# Altium project MB1167.PrjPCB (part 2 of 3)

## Sheet MotorControl.SchDoc: Motor Control
size A4; DocumentNumber: MB1167; Revision: B.1; SheetNumber: 13; SheetTotal: 17; Project: STM327x6G-EVAL
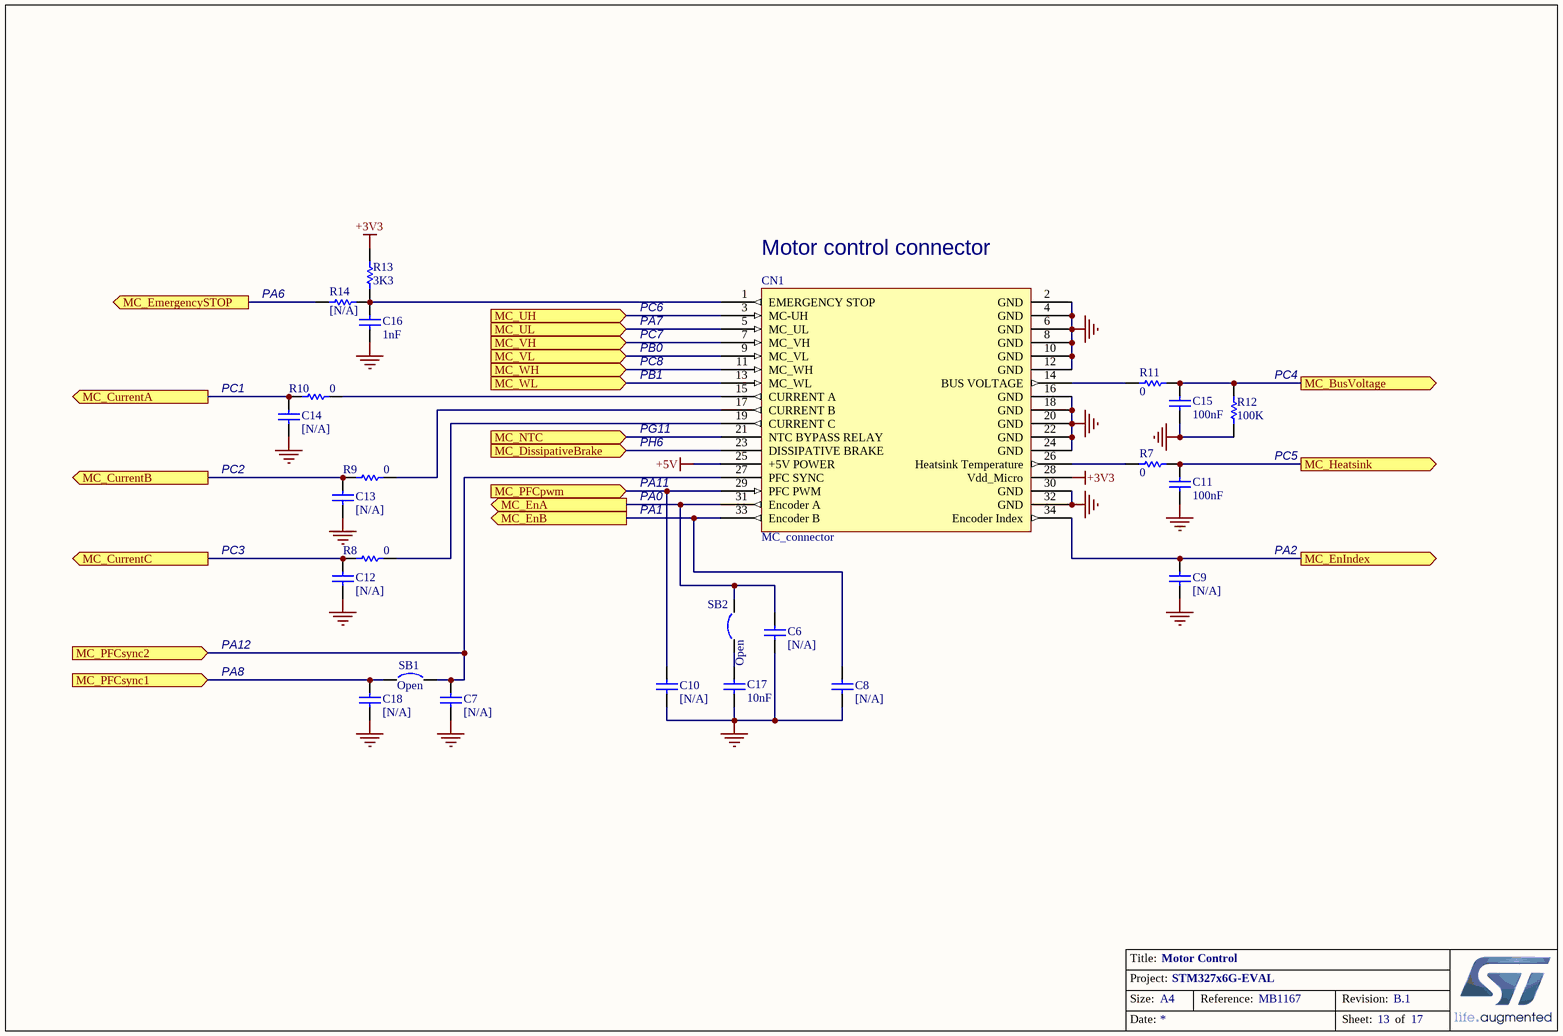
[diagram p7: MotorControl.SchDoc]

### Parts
C6  [N/A]  [0603C]
C7  [N/A]  [0603C]
C8  [N/A]  [0603C]
C9  [N/A]  [0603C]
C10  [N/A]  [0603C]
C11  100nF  [0603C]
C12  [N/A]  [0603C]
C13  [N/A]  [0603C]
C14  [N/A]  [0603C]
C15  100nF  [0603C]
C16  1nF  [0603C]
C17  10nF  [0603C]
C18  [N/A]  [0603C]
CN1  MC_connector  [IDC34S]
R7  0  [0603R]
R8  0  [0603R]
R9  0  [0603R]
R10  0  [0603R]
R11  0  [0603R]
R12  100K  [0603R]
R13  3K3  [0603R]
R14  [N/A]  [0603R]
SB1  Open  [SB_0603]
SB2  Open  [SB_0603]

### Ports
MC_BusVoltage (out), MC_CurrentA (out), MC_CurrentB (out), MC_CurrentC (out), MC_DissipativeBrake (in), MC_EmergencySTOP (out), MC_EnA (out), MC_EnB (out), MC_EnIndex (out), MC_Heatsink (out), MC_NTC (in), MC_PFCpwm (in), MC_PFCsync1 (in), MC_PFCsync2 (in), MC_UH (in), MC_UL (in), MC_VH (in), MC_VL (in), MC_WH (in), MC_WL (in)

### Nets
+3V3: CN1.28(Vdd_Micro) R13.2
+5V: CN1.25(+5V_POWER)
GND: C6.1 C7.1 C8.1 C9.1 C10.1 C11.2 C12.1 C13.1 C14.1 C15.2 C16.1 C17.2 C18.1 CN1.2(GND) CN1.4(GND) CN1.6(GND) CN1.8(GND) CN1.10(GND) CN1.12(GND) CN1.16(GND) CN1.18(GND) CN1.20(GND) CN1.22(GND) CN1.24(GND) CN1.30(GND) CN1.32(GND) R12.2
PA6: R14.2 ; port MC_EmergencySTOP
PAR_D1: CN1.7(MC_VH) ; port MC_VH
NetC6_2: C6.2 CN1.31(Encoder_A) SB2.2 ; port MC_EnA
NetC7_2: C7.2 CN1.27(PFC_SYNC) SB1.2 ; port MC_PFCsync2
NetC8_2: C8.2 CN1.33(Encoder_B) ; port MC_EnB
NetC9_2: C9.2 CN1.34(Encoder_Index) ; port MC_EnIndex
NetC10_2: C10.2 CN1.29(PFC_PWM) ; port MC_PFCpwm
NetC11_1: C11.1 R7.2 ; port MC_Heatsink
NetC12_2: C12.2 R8.1 ; port MC_CurrentC
NetC13_2: C13.2 R9.1 ; port MC_CurrentB
NetC14_2: C14.2 R10.1 ; port MC_CurrentA
NetC15_1: C15.1 R11.2 R12.1 ; port MC_BusVoltage
NetC16_2: C16.2 CN1.1(EMERGENCY_STOP) R13.1 R14.1
NetC17_1: C17.1 SB2.1
NetC18_2: C18.2 SB1.1 ; port MC_PFCsync1
NetCN1_3: CN1.3(MC-UH) ; port MC_UH
NetCN1_5: CN1.5(MC_UL) ; port MC_UL
NetCN1_9: CN1.9(MC_VL) ; port MC_VL
NetCN1_11: CN1.11(MC_WH) ; port MC_WH
NetCN1_13: CN1.13(MC_WL) ; port MC_WL
NetCN1_14: CN1.14(BUS_VOLTAGE) R11.1
NetCN1_15: CN1.15(CURRENT_A) R10.2
NetCN1_17: CN1.17(CURRENT_B) R9.2
NetCN1_19: CN1.19(CURRENT_C) R8.2
NetCN1_21: CN1.21(NTC_BYPASS_RELAY) ; port MC_NTC
NetCN1_23: CN1.23(DISSIPATIVE_BRAKE) ; port MC_DissipativeBrake
NetCN1_26: CN1.26(Heatsink_Temperature) R7.1

### Notes on the sheet
- (near R14) PA6
- PC6
- (near CN1) Motor control connector
- PA7
- PB0
- PB1
- PC7
- PC8
- (near R12) PC4
- PC1
- PG11
- PH6
- PC2
- PA1
- PA0
- PA11
- (near R12) PC5
- PC3
- PA2
- PA12
- PA8
- Title:
- Project:
- Size:
- Date:
- A4
- Reference:
- Sheet:
- Revision:
- of

### Library data of the parts
C6-C10 C12-C14 C18 = cap: Capacitor; Value: 100pF; Published: 8-Jun-2000; Revision: July-2002: Re-released for DXP Platform.; Publisher: Altium Limited
C11 C15 = Cap: Capacitor; Value: 10nF; Published: 8-Jun-2000; Revision: July-2002: Re-released for DXP Platform.; Publisher: Altium Limited
C16 C17 = CAP: Capacitor; Value: 100pF; Published: 8-Jun-2000; Revision: July-2002: Re-released for DXP Platform.; Publisher: Altium Limited
R7-R11 R13 R14 = Res1: Resistor; Value: 1K; Published: 8-Jun-2000; Revision: July-2002: Re-released for DXP Platform.; Publisher: Altium Limited
R12 = res1: Resistor; Value: 1K; Published: 8-Jun-2000; Revision: July-2002: Re-released for DXP Platform.; Publisher: Altium Limited
SB1 SB2 = Circuit Breaker: Published: 24-Mar-1999; Revision: July-2002: Re-released for DXP Platform.; Publisher: Altium Limited

## Sheet Peripherals.SchDoc: Peripherals
size A4; DocumentNumber: MB1167; Revision: B.1; SheetNumber: 12; SheetTotal: 17; Project: STM327x6G-EVAL
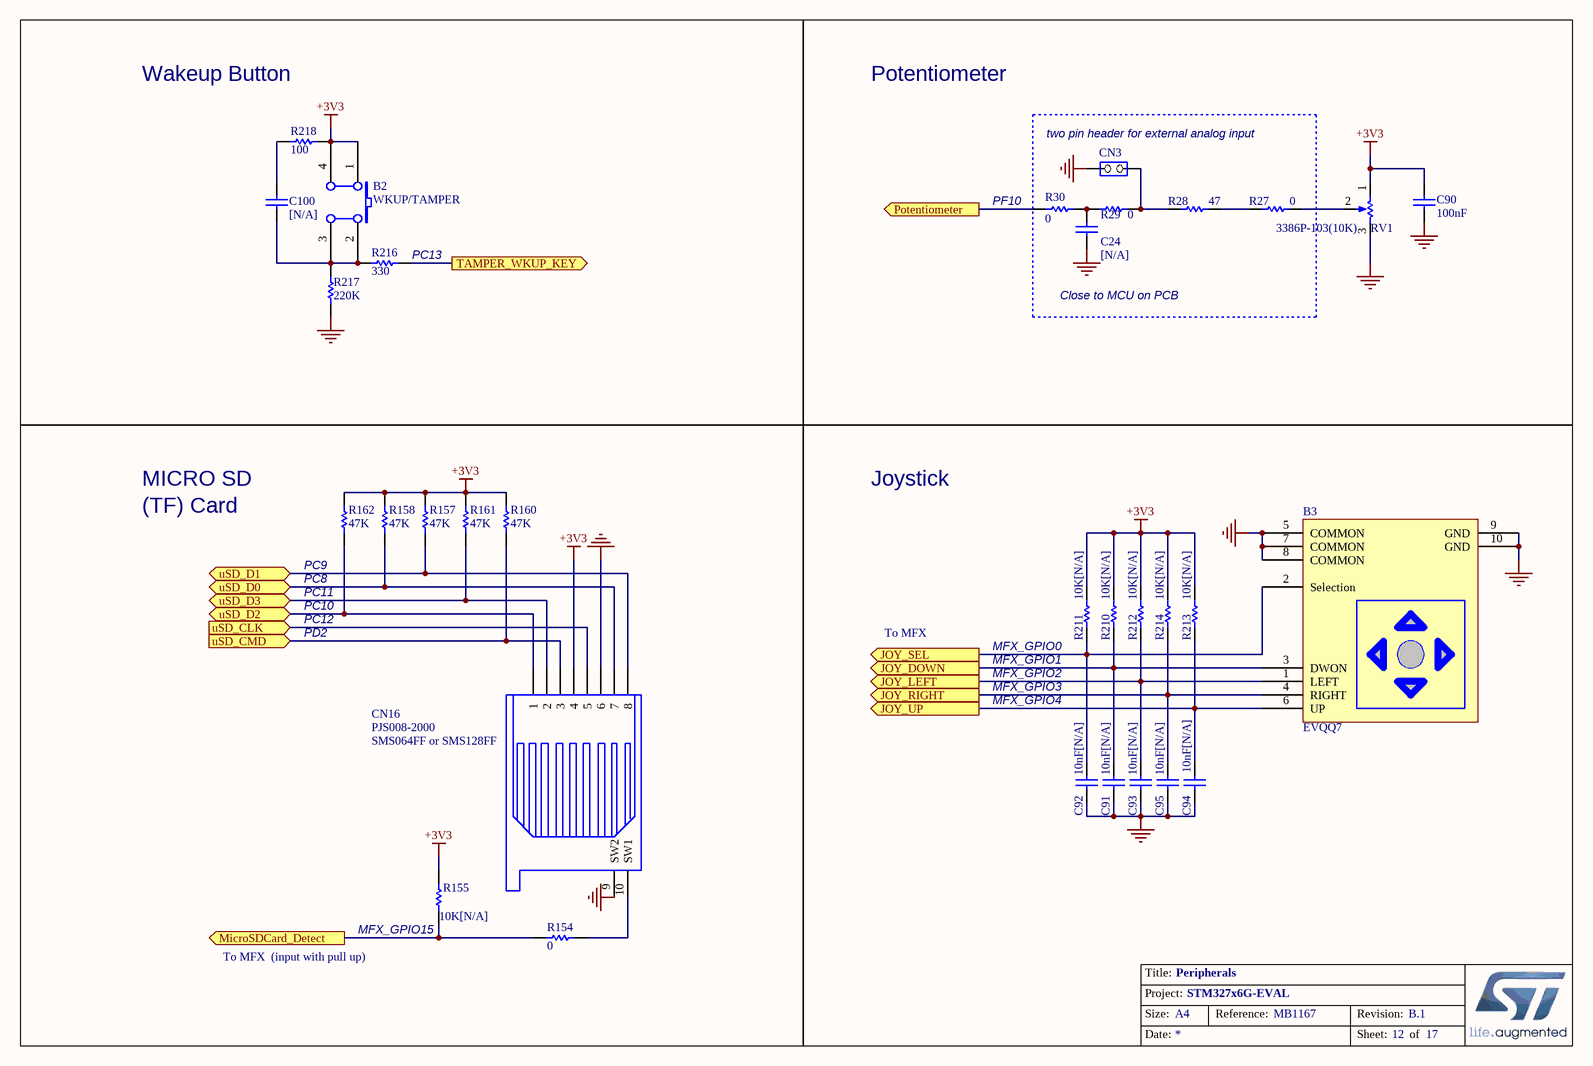
[diagram p8: Peripherals.SchDoc]

### Parts
B2  WKUP/TAMPER  [PB10]
B3  EVQQ7  [SW-JOY]
C24  [N/A]  [0603C]
C90  100nF  [0603C]
C91  10nF[N/A]  [0603C]
C92  10nF[N/A]  [0603C]
C93  10nF[N/A]  [0603C]
C94  10nF[N/A]  [0603C]
C95  10nF[N/A]  [0603C]
C100  [N/A]  [0603C]
CN3  (no value)  [SIP2]
CN16  PJS008-2000  [MSD_PJS008_]
R27  0  [0603R]
R28  47  [0603R]
R29  0  [0603R]
R30  0  [0603R]
R154  0  [0603R]
R155  10K[N/A]  [0603R]
R157  47K  [0603R]
R158  47K  [0603R]
R160  47K  [0603R]
R161  47K  [0603R]
R162  47K  [0603R]
R210  10K[N/A]  [0603R]
R211  10K[N/A]  [0603R]
R212  10K[N/A]  [0603R]
R213  10K[N/A]  [0603R]
R214  10K[N/A]  [0603R]
R216  330  [0603R]
R217  220K  [0603R]
R218  100  [0603R]
RV1  3386P-103(10K)  [3386P]

### Ports
JOY_DOWN (out), JOY_LEFT (out), JOY_RIGHT (out), JOY_SEL (out), JOY_UP (out), MicroSDCard_Detect (out), Potentiometer (out), TAMPER_WKUP_KEY (out), uSD_CLK (in), uSD_CMD (in), uSD_D0 (bidir), uSD_D1 (bidir), uSD_D2 (bidir), uSD_D3 (bidir)

### Nets
+3V3: B2.1(A0) B2.4(A1) C90.1 CN16.4 R155.2 R157.1 R158.1 R160.1 R161.1 R162.1 R210.1 R211.1 R212.1 R213.1 R214.1 R218.1 RV1.1(BOT)
GND: B3.5(COMMON) B3.7(COMMON) B3.8(COMMON) B3.9(GND) B3.10(GND) C24.1 C90.2 C91.1 C92.1 C93.1 C94.1 C95.1 CN3.2(NO) CN16.6 CN16.9(SW2) R217.2 RV1.3(TOP)
PAR_D9: CN16.5 ; port uSD_CLK
PC13: R216.2 ; port TAMPER_WKUP_KEY
NetB2_2: B2.2(B0) B2.3(B1) C100.2 R216.1 R217.1
NetB3_1: B3.1(LEFT) C93.2 R212.2 ; port JOY_LEFT
NetB3_2: B3.2(Selection) C92.2 R211.2 ; port JOY_SEL
NetB3_3: B3.3(DWON) C91.2 R210.2 ; port JOY_DOWN
NetB3_4: B3.4(RIGHT) C95.2 R214.2 ; port JOY_RIGHT
NetB3_6: B3.6(UP) C94.2 R213.2 ; port JOY_UP
NetC24_2: C24.2 R29.1 R30.1
NetC100_1: C100.1 R218.2
NetCN3_1: CN3.1(COMMON) R28.1 R29.2
NetCN16_1: CN16.1 R162.2 ; port uSD_D2
NetCN16_2: CN16.2 R161.2 ; port uSD_D3
NetCN16_3: CN16.3 R160.2 ; port uSD_CMD
NetCN16_7: CN16.7 R158.2 ; port uSD_D0
NetCN16_8: CN16.8 R157.2 ; port uSD_D1
NetCN16_10: CN16.10(SW1) R154.2
NetJP24_1: R30.2 ; port Potentiometer
NetR27_1: R27.1 R28.2
NetR27_2: R27.2 RV1.2(TAP)
NetR154_1: R154.1 R155.1 ; port MicroSDCard_Detect

### Notes on the sheet
- Wakeup Button
- Potentiometer
- (near CN3) two pin header for external analog input
- (near R216) PC13
- (near R30) PF10
- Close to MCU on PCB
- MICRO SD
- (TF) Card
- Joystick
- (near R162) PC8
- (near R162) PC9
- PC11
- PC10
- PC12
- PD2
- To MFX
- (near R211) MFX_GPIO0
- MFX_GPIO1
- MFX_GPIO2
- MFX_GPIO3
- MFX_GPIO4
- (near CN16) SMS064FF or SMS128FF
- (near R155) MFX_GPIO15
- To MFX  (input with pull up)
- Title:
- Project:
- Size:
- Date:
- A4
- Reference:
- Sheet:
- Revision:
- of

### Library data of the parts
B2 = SW PUSHBUTTON: SE PUSHBUTTON
C24 = cap: Capacitor; Value: 100pF; Published: 8-Jun-2000; Revision: July-2002: Re-released for DXP Platform.; Publisher: Altium Limited
C90-C95 C100 = CAP: Capacitor; Value: 100pF; Published: 8-Jun-2000; Revision: July-2002: Re-released for DXP Platform.; Publisher: Altium Limited
CN3 = JP2
CN16 = SMS016AFA5E
R27-R30 R154 R155 R216 R218 = Res1: Resistor; Value: 1K; Published: 8-Jun-2000; Revision: July-2002: Re-released for DXP Platform.; Publisher: Altium Limited
R157 R158 R160-R162 R210-R214 R217 = res1: Resistor; Value: 1K; Published: 8-Jun-2000; Revision: July-2002: Re-released for DXP Platform.; Publisher: Altium Limited
RV1 = RV

## Sheet Power.SchDoc: Power
size A4; DocumentNumber: MB1167; Revision: B.1; SheetNumber: 3; SheetTotal: 17; Project: STM327x6G-EVAL
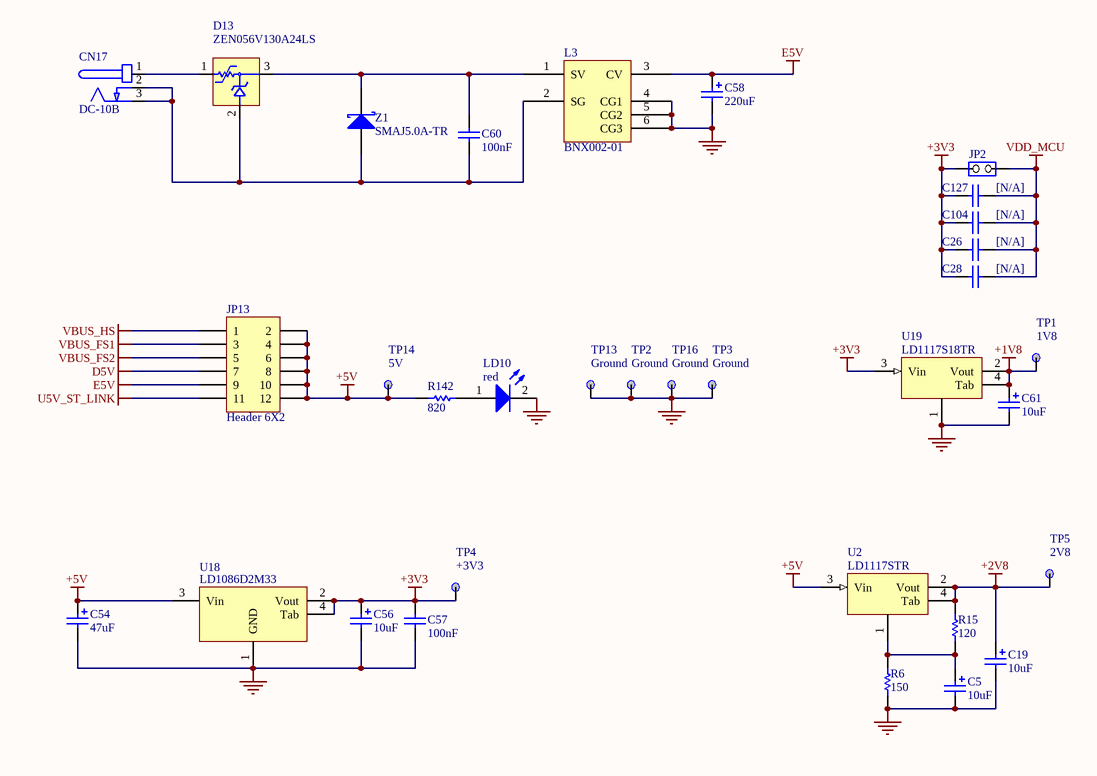
[diagram p9: Power.SchDoc]

### Parts
C5  10uF  [TAN-A]
C19  10uF  [TAN-A]
C26  [N/A]  [0603C]
C28  [N/A]  [0603C]
C54  47uF  [CAE_5R3X5R3_H5R4]
C56  10uF  [TAN-A]
C57  100nF  [0603C]
C58  220uF  [c310m-6]
C60  100nF  [0603C]
C61  10uF  [TAN-A]
C104  [N/A]  [0603C]
C127  [N/A]  [0603C]
CN17  DC-10B  [PWR_JACK_DC10]
D13  ZEN056V130A24LS  [TYCO_ZEN056V130A24LS]
JP2  (no value)  [SIP2]
JP13  Header 6X2  [HDR_2X6_2R54]
L3  BNX002-01  [BNX001]
LD10  red  [0603D]
R6  150  [0603R]
R15  120  [0603R]
R142  820  [0603R]
TP1  1V8  [TP]
TP2  Ground  [TP]
TP3  Ground  [TP]
TP4  +3V3  [TP]
TP5  2V8  [TP]
TP13  Ground  [TP]
TP14  5V  [TP]
TP16  Ground  [TP]
U2  LD1117STR  [SOT-223]
U18  LD1086D2M33  [TO263-3]
U19  LD1117S18TR  [SOT-223]
Z1  SMAJ5.0A-TR  [sma]

### Nets
+1V8: C61.1 TP1.1 U19.2(Vout) U19.4(Tab)
+2V8: C19.1 R15.1 TP5.1 U2.2(Vout) U2.4(Tab)
+3V3: C26.1 C28.1 C56.1 C57.1 C104.1 C127.1 JP2.1(COMMON) TP4.1 U18.2(Vout) U18.4(Tab) U19.3(Vin)
+5V: C54.1 JP13.2 JP13.4 JP13.6 JP13.8 JP13.10 JP13.12 R142.2 TP14.1 U2.3(Vin) U18.3(Vin)
D5V: JP13.7
E5V: C58.1 JP13.9 L3.3(CV)
GND: C5.2 C19.2 C54.2 C56.2 C57.2 C58.2 C61.2 L3.4(CG1) L3.5(CG2) L3.6(CG3) LD10.2(K) R6.2 TP2.1 TP3.1 TP13.1 TP16.1 U18.1(GND) U19.1
U5V_ST_LINK: JP13.11
VBUS_FS1: JP13.3
VBUS_FS2: JP13.5
VBUS_HS: JP13.1
VDD_MCU: C26.2 C28.2 C104.2 C127.2 JP2.2(NO)
NetC5_1: C5.1 R6.1 R15.2 U2.1
NetC60_1: C60.1 D13.3 L3.1(SV) Z1.2(K)
NetC60_2: C60.2 CN17.2(GND) CN17.3(GND) D13.2 L3.2(SG) Z1.1(A)
NetCN17_1: CN17.1(+) D13.1
NetLD10_1: LD10.1(A) R142.1

### Notes on the sheet
- Title:
- Project:
- Size:
- Date:
- A4
- Reference:
- Sheet:
- Revision:
- of

### Library data of the parts
C5 C19 C56 C61 = Cap Pol1: Polarized Capacitor (Radial); Published: 8-Jun-2000; Revision: July-2002: Re-released for DXP Platform.; Publisher: Altium Limited; Value: 10uF
C26 C28 C57 C104 C127 = Cap: Capacitor; Value: 10nF; Published: 8-Jun-2000; Revision: July-2002: Re-released for DXP Platform.; Publisher: Altium Limited
C54 = Cap Pol1: Polarized Capacitor (Radial); Value: 10uF; Published: 8-Jun-2000; Revision: July-2002: Re-released for DXP Platform.; Publisher: Altium Limited
C58 = Cap Pol1: Polarized Capacitor (Radial); Value: 47uF; Published: 8-Jun-2000; Revision: July-2002: Re-released for DXP Platform.; Publisher: Altium Limited
C60 = CAP: Capacitor; Value: 100pF; Published: 8-Jun-2000; Revision: July-2002: Re-released for DXP Platform.; Publisher: Altium Limited
CN17 = PJ202A
JP2 = JP2
JP13 = Header 6X2: Header, 6-Pin, Dual row; Revision: 17-Jul-2002: Re-released for DXP Platform.; Publisher: Altium Limited
L3 = BNX002
LD10 = LED2: Typical RED, GREEN, YELLOW, AMBER GaAs LED; Published: 8-Jun-2000; Revision: July-2002: Re-released for DXP Platform.; Publisher: Altium Limited
R6 R15 R142 = res1: Resistor; Value: 1K; Published: 8-Jun-2000; Revision: July-2002: Re-released for DXP Platform.; Publisher: Altium Limited
TP1-TP5 TP13 TP14 TP16 = TP
U2 U19 = LD1117
U18 = VOLTREG1
Z1 = D Schottky: Schottky Diode; Code - JEDEC: DO-214-AA; Published: 8-Jun-2000; Revision: July-2002: Re-released for DXP Platform.; Publisher: Altium Limited

## Sheet ST_LINK_V2-1.SCHDOC: ST-LINK/V2-1
size A4; DocumentNumber: MB1167; Revision: B.1; SheetNumber: 15; SheetTotal: 17; Project: STM327x6G-EVAL
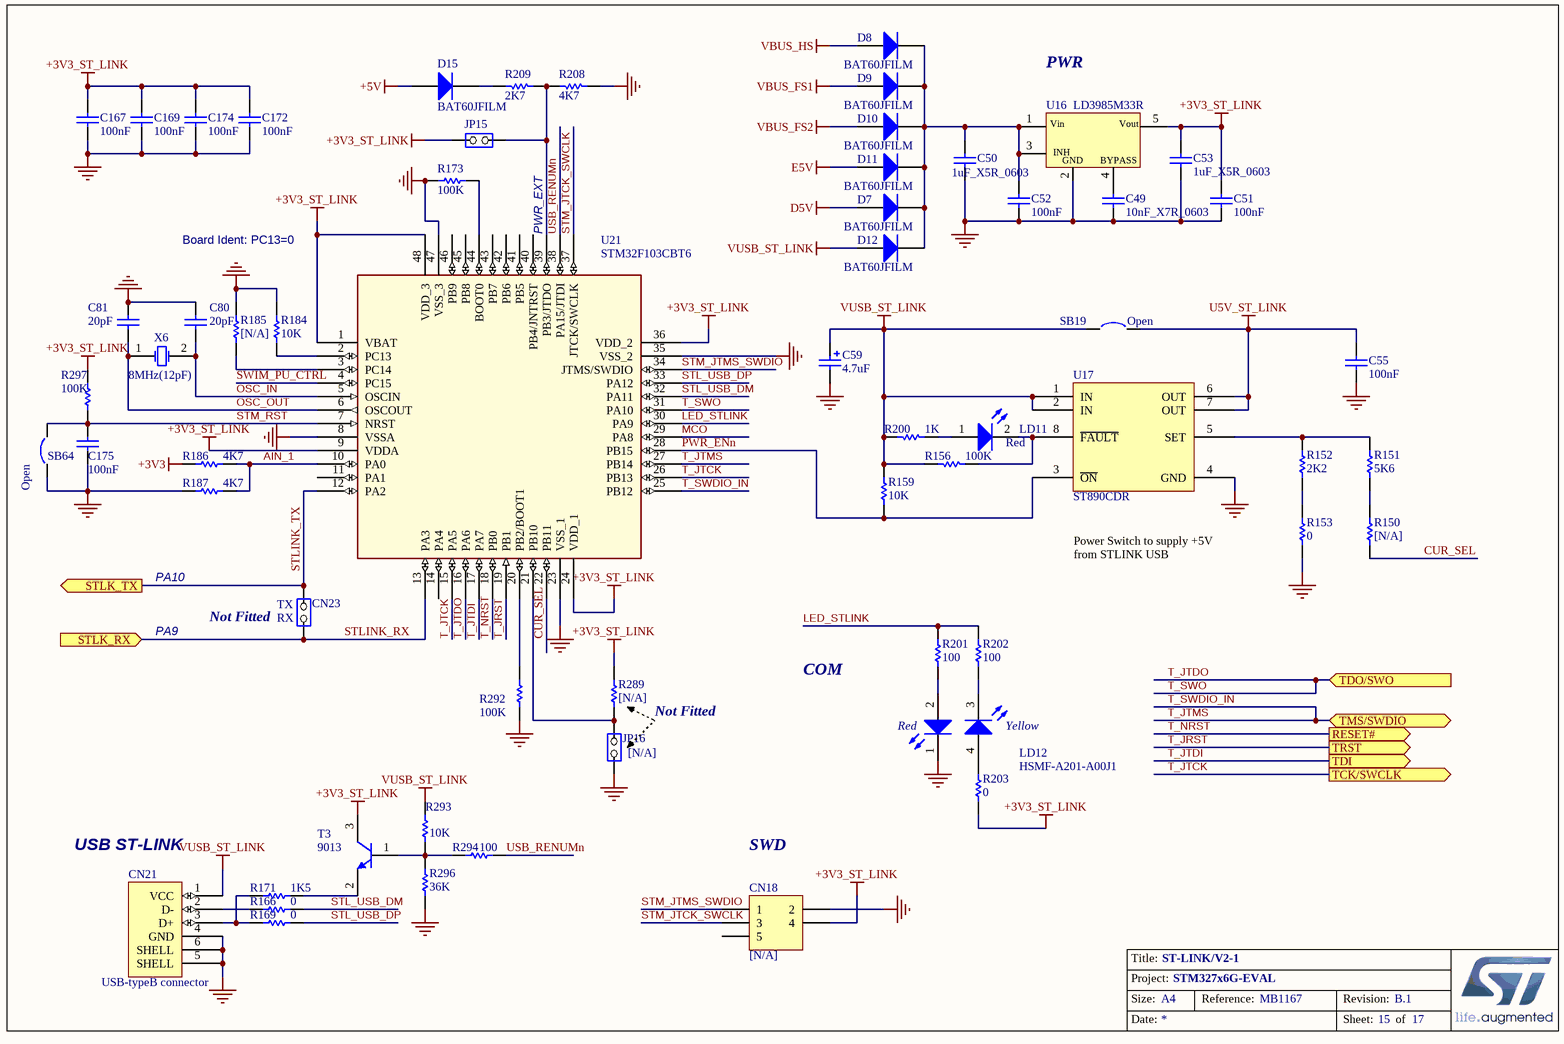
[diagram p10: ST_LINK_V2-1.SCHDOC]

### Parts
C49  10nF_X7R_0603  [0603C]
C50  1uF_X5R_0603  [0603C]
C51  100nF  [0603C]
C52  100nF  [0603C]
C53  1uF_X5R_0603  [0603C]
C55  100nF  [0603C]
C59  4.7uF  [TAN-A]
C80  20pF  [0603C]
C81  20pF  [0603C]
C167  100nF  [0603C]
C169  100nF  [0603C]
C172  100nF  [0603C]
C174  100nF  [0603C]
C175  100nF  [0603C]
CN18  [N/A]  [HDR_2X3-1_2R54-6]
CN21  USB-typeB connector  [USB-B]
CN23  (no value)  [SIP2]
D7  BAT60JFILM  [SOD-323]
D8  BAT60JFILM  [SOD-323]
D9  BAT60JFILM  [SOD-323]
D10  BAT60JFILM  [SOD-323]
D11  BAT60JFILM  [SOD-323]
D12  BAT60JFILM  [SOD-323]
D15  BAT60JFILM  [SOD-323]
JP15  (no value)  [SIP2]
JP16  [N/A]  [SIP2]
LD11  Red  [0603D]
LD12  HSMF-A201-A00J1  [LED2_3528]
R150  [N/A]  [0603R]
R151  5K6  [0402R]
R152  2K2  [0402R]
R153  0  [0603R]
R156  100K  [0603R]
R159  10K  [0402R]
R166  0  [0603R]
R169  0  [0603R]
R171  1K5  [0603R]
R173  100K  [0603R]
R184  10K  [0603R]
R185  [N/A]  [0603R]
R186  4K7  [0603R]
R187  4K7  [0603R]
R200  1K  [0603R]
R201  100  [0603R]
R202  100  [0603R]
R203  0  [0603R]
R208  4K7  [0603R]
R209  2K7  [0603R]
R289  [N/A]  [0603R]
R292  100K  [0603R]
R293  10K  [0603R]
R294  100  [0603R]
R296  36K  [0603R]
R297  100K  [0603R]
SB19  Open  [SB_0603]
SB64  Open  [SB_0603]
T3  9013  [SOT-23]
U16  LD3985M33R  [SOT23-5]
U17  ST890CDR  [SOIC8_1R27_4R9X6]
U21  STM32F103CBT6  [LQFP48_0R5_9X9]
X6  8MHz(12pF)  [XTAL_2SM_12R7X4R7]

### Ports
RESET# (out), STLK_RX (in), STLK_TX (out), TCK/SWCLK (out), TDI (out), TDO/SWO (in), TMS/SWDIO (bidir), TRST (out)

### Nets
+3V3: R186.1
+3V3_ST_LINK: C51.2 C53.1 C167.2 C169.2 C172.2 C174.2 CN18.4 JP15.1(COMMON) R203.2 R289.1 R297.2 T3.3(C) U16.5(Vout) U21.1(VBAT) U21.9(VDDA) U21.24(VDD_1) U21.36(VDD_2) U21.48(VDD_3)
+5V: D15.1(A)
D5V: D7.1(A)
E5V: D11.1(A)
GND: C49.1 C50.1 C51.1 C52.1 C53.2 C55.1 C59.2 C80.2 C81.2 C167.1 C169.1 C172.1 C174.1 C175.1 CN18.2 CN21.4(GND) CN21.5(SHELL) CN21.6(SHELL) JP16.1(COMMON) LD12.1(RED_cathode) R153.1 R173.1 R184.1 R185.1 R187.1 R208.2 R292.1 R296.1 SB64.1 U16.2(GND) U17.4(GND) U21.8(VSSA) U21.23(VSS_1) U21.35(VSS_2) U21.47(VSS_3)
U5V_ST_LINK: C55.2 SB19.2 U17.6(OUT) U17.7(OUT)
VBUS_FS1: D9.1(A)
VBUS_FS2: D10.1(A)
VBUS_HS: D8.1(A)
VUSB_ST_LINK: C59.1 CN21.1(VCC) D12.1(A) R156.1 R159.1 R200.1 R293.2 SB19.1 U17.1(IN) U17.2(IN)
AIN_1: R186.2 R187.2 U21.10(PA0)
CUR_SEL: R150.1 U21.22(PB11)
LED_STLINK: R201.1 R202.1 U21.30(PA9)
MCO: U21.29(PA8)
OSC_IN: C80.1 U21.5(OSCIN) X6.2(OSC2)
OSC_OUT: C81.1 U21.6(OSCOUT) X6.1(OSC1)
PWR_ENn: R159.2 U17.3(~{ON}) U21.28(PB15)
STL_USB_DM: R166.2 U21.32(PA11)
STL_USB_DP: R169.2 U21.33(PA12)
STLINK_RX: CN23.1(COMMON) U21.13(PA3) ; port STLK_RX
STLINK_TX: CN23.2(NO) U21.12(PA2) ; port STLK_TX
STM_JTCK_SWCLK: CN18.3 U21.37(JTCK/SWCLK)
STM_JTMS_SWDIO: CN18.1 U21.34(JTMS/SWDIO)
STM_RST: C175.2 R297.1 SB64.2 U21.7(NRST)
SWIM_PU_CTRL: U21.4(PC15)
T_JRST: U21.19(PB1) ; port TRST  [project net PB4]
T_JTCK: U21.15(PA5) U21.26(PB13) ; port TCK/SWCLK  [project net PA14]
T_JTDI: U21.17(PA7) ; port TDI  [project net PA15]
T_JTDO: U21.16(PA6) U21.31(PA10) ; port TDO/SWO  [also labelled T_SWO]
T_JTMS: U21.25(PB12) U21.27(PB14) ; port TMS/SWDIO  [also labelled T_SWDIO_IN]  [project net PA13]
T_NRST: U21.18(PB0) ; port RESET#  [project net RESET#]
USB_RENUMn: R294.2 U21.38(PA15/JTDI)
NetC49_2: C49.2 U16.4(BYPASS)
NetC50_2: C50.2 C52.2 D7.2(K) D8.2(K) D9.2(K) D10.2(K) D11.2(K) D12.2(K) U16.1(Vin) U16.3(CE)
NetCN21_2: CN21.2(D-) R166.1
NetCN21_3: CN21.3(D+) R169.1 R171.1
NetD15_2: D15.2(K) R209.1
NetJP15_2: JP15.2(NO) R208.1 R209.2 U21.39(PB3/JTDO)
NetJP16_2: JP16.2(NO) R289.2 U21.21(PB10)
NetLD11_1: LD11.1(A) R200.2
NetLD11_2: LD11.2(K) R156.2 U17.8(~{FAULT})
NetLD12_2: LD12.2(Red_anode) R201.2
NetLD12_3: LD12.3(YellowGreen_cathode) R202.2
NetLD12_4: LD12.4(YellowGreen_anode) R203.1
NetR150_2: R150.2 R151.1
NetR151_2: R151.2 R152.2 U17.5(SET)
NetR152_1: R152.1 R153.2
NetR171_2: R171.2 T3.2(E)
NetR173_2: R173.2 U21.44(BOOT0)
NetR184_2: R184.2 U21.2(PC13)
NetR185_2: R185.2 U21.3(PC14)
NetR292_2: R292.2 U21.20(PB2/BOOT1)
NetR293_1: R293.1 R294.1 R296.2 T3.1(B)

Not connected (* = marked no-connect by the designer): CN18 5; U21 11(PA1) 14(PA4) 40(PB4/JNTRST) 41(PB5) 42(PB6) 43(PB7) 45(PB8) 46(PB9)

### Notes on the sheet
- PWR
- Board Ident: PC13=0
- (near U21) PWR_EXT
- PA10
- Power Switch to supply +5V from STLINK USB
- PA9
- (near CN23) Not Fitted
- (near CN23) TX
- (near CN23) RX
- Not Fitted
- COM
- (near CN21) USB ST-LINK
- SWD
- Title:
- Project:
- Size:
- Date:
- A4
- Reference:
- Sheet:
- Revision:
- of
- (in symbol HSMF-A201-A00J1) Red; Yellow
- (in symbol LD3985M33R) INH

### Library data of the parts
C49 = CAP SMD 0603  X7R 10000PF 50V 10%: 0603  X7R 10NF; Order code RS: 2040779; Rated voltage: 50V; Tolerance: 10%; Order code Farnell: 7569548RL; Value: 10NF; Power: *; Technology: X7R; Temperature Factor: *; Temperature Min: -55°C; Temperature Max: +125°C; STS Code: *
C50 C53 = CAP SMD 0603  X5R 1µF 25V 10%: 0603  X5R 1µF; Rated voltage: 25V; Tolerance: 10%; Manufacturer: *; Manufacturer P/N: *; Order code Farnell: 1288202RL; Value: 1µF; Power: *; Technology: X5R; Temperature  Factor: *; Temperature Max: +125°C; Temperature Min: -55°C; STS Code: *
C51 C52 C55 C167 C169 C172 C174 C175 = Capacitor_ST: Capacitor 0402 / 0603 / 0805; Revision: July-2002: Re-released for DXP Platform.; Value: 100nF
C59 = Cap Pol1: Polarized Capacitor (Radial); Value: 100pF; Ordered by: Subcon; Published: 8-Jun-2000; Revision: July-2002: Re-released for DXP Platform.; Publisher: Altium Limited
C80 C81 = Capacitor_ST: Capacitor 0402 / 0603 / 0805; Value: 100nF; Revision: July-2002: Re-released for DXP Platform.
CN18 = Header 3X2: Header, 3-Pin, Dual row; Revision: 17-Jul-2002: Re-released for DXP Platform.; Publisher: Altium Limited
CN23 = JP2: Fitted: NO
D7-D12 = BAT60JFILM: Manuf_1: STM; Provided: ST; ECCN_US/EU: EAR99/NEC; Revision: July-2002: Re-released for DXP Platform.; Order: BAT60JFILM; Manuf_Part_1: BAT60JFILM; Distrib: ST
D15 = Diode: Default Diode; Code - JEDEC: DO-214-AB; Ordered by: STM; ECCN_US/EU: EAR99/NEC; Published: 8-Jun-2000; Revision: July-2002: Re-released for DXP Platform.; Publisher: Altium Limited
JP15 = JP2: Ordered by: Subcon; Silkscreen: Pwr_ext
JP16 = JP2
LD11 = LED2: as LD10 on sheet Power; Published: 8-Jun-2000; Revision: July-2002: Re-released for DXP Platform.; Publisher: Altium Limited
R150 R153 R201-R203 R208 R209 R289 R293 R296 = Res1: Resistor; Value: 1K; Published: 8-Jun-2000; Revision: July-2002: Re-released for DXP Platform.; Publisher: Altium Limited
R151 R152 R166 R169 R171 R173 R292 R294 R297 = Resistor_ST: Resistor 0402 / 0603 / 0805; Description: Resistor 0402 or 0603 or 0805; Value: 10K
R156 = Res1: Resistor; Value: 1K; Ordered by: Subcon; Published: 8-Jun-2000; Revision: July-2002: Re-released for DXP Platform.; Publisher: Altium Limited
R159 R184 = Resistor_ST: Resistor 0402 / 0603 / 0805; Description: Resistor 0402 or 0603 or 0805; Value: 10K
R185-R187 = Resistor_ST: Resistor 0402 / 0603 / 0805; Description: Resistor 0402 or 0603 or 0805; Value: 10K; Fitted: NO
R200 = Res1: Resistor; Ordered by: Subcon; Published: 8-Jun-2000; Revision: July-2002: Re-released for DXP Platform.; Publisher: Altium Limited; Value: 1K
SB19 SB64 = Circuit Breaker: Published: 24-Mar-1999; Revision: July-2002: Re-released for DXP Platform.; Publisher: Altium Limited
T3 = NPN: NPN Bipolar Transistor; Code - JEDEC: TO-226-AA; Published: 8-Jun-2000; Revision: July-2002: Re-released for DXP Platform.; Publisher: Altium Limited
U16 = LD3985M33R: Ultra low drop-low noise BiCMOS voltage, regulators low ESR capacitors compatible; Manuf_1: STM; Provided: ST; Ref St: 9176161; ECCN_US/EU: EAR99/NEC; Manuf_Part_1: LD3985M33R; Distrib: ST; Order: LD3985M33R
U21 = STM32F103CBT6: Medium-density performance line ARM-based 32-bit MCU with 64KB Flash; Manuf_Part_1: STM32F103C8T6; Manuf_1: STM; Ref St: 9175981; Provided: ST; ECCN_US/EU: 3A991A2/NEC; Footprint: QFP48 7X7; Distrib: ST; Order: STM32F103C8T6
X6 = XTAL: Crystal Oscillator; Published: 8-Jun-2000; LatestRevisionDate: 17-Jul-2002; LatestRevisionNote: Re-released for DXP Platform.; PackageReference: R38; Publisher: Altium Limited

## Sheet USB_OTG.SchDoc: USB_OTG_HS
size A4; DocumentNumber: MB1167; Revision: B.1; SheetNumber: 8; SheetTotal: 17; Project: STM327x6G-EVAL
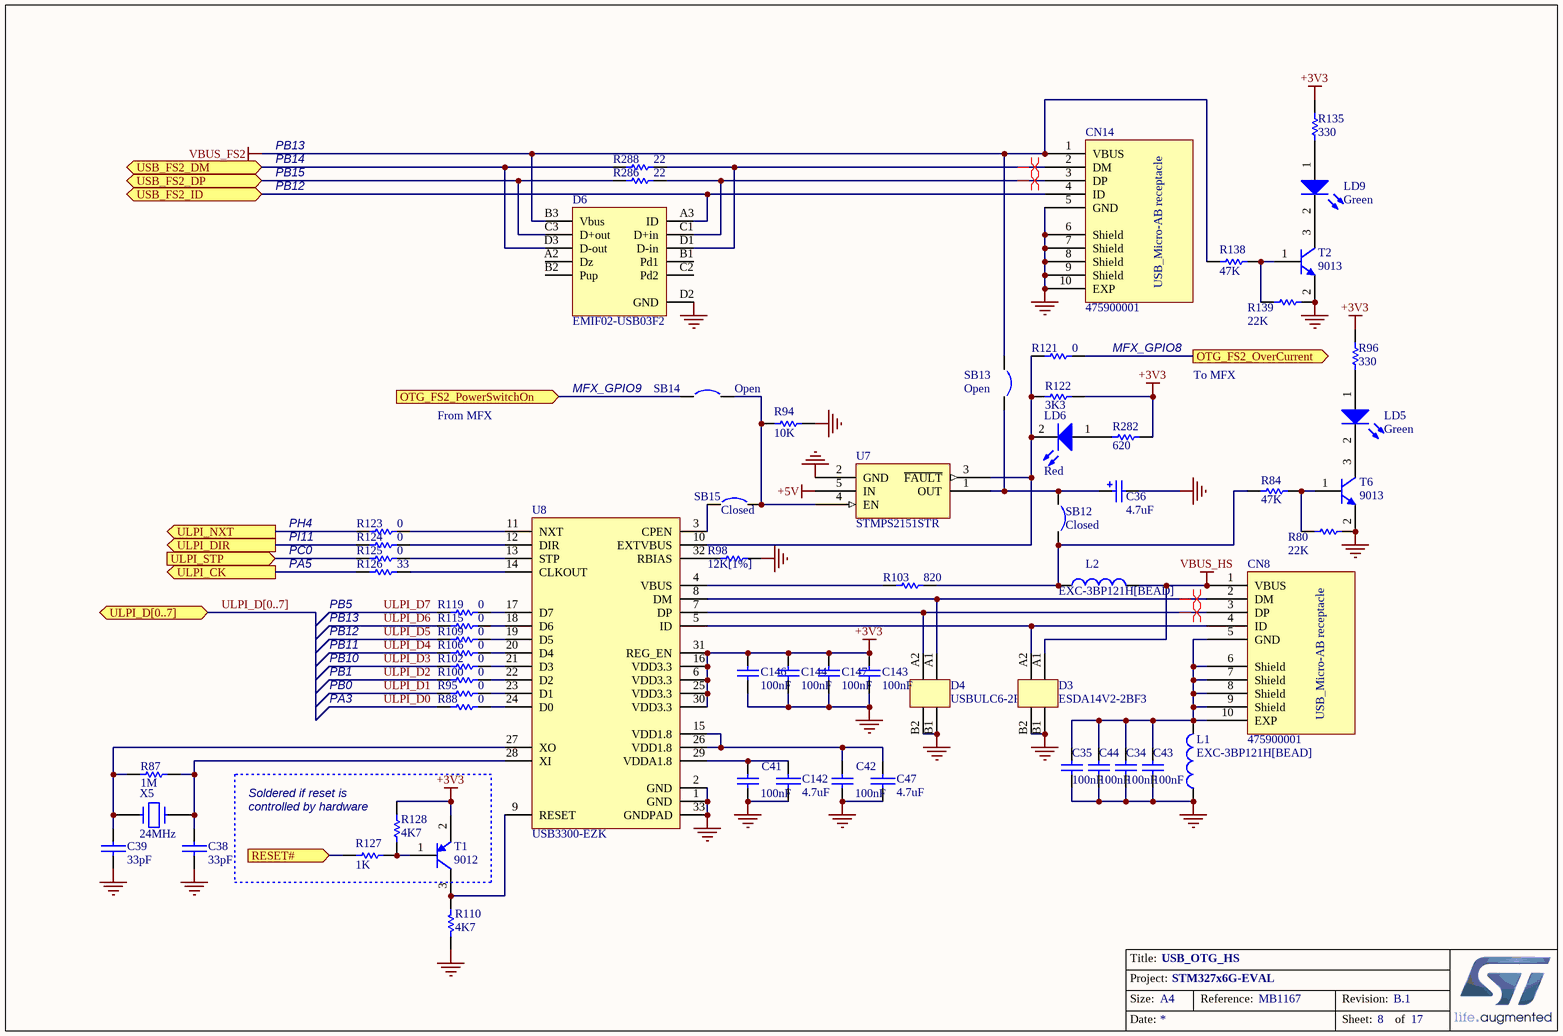
[diagram p11: USB_OTG.SchDoc]

### Parts
C34  100nF  [0603C]
C35  100nF  [0603C]
C36  4.7uF  [TAN-A]
C38  33pF  [0603C]
C39  33pF  [0603C]
C41  100nF  [0603C]
C42  100nF  [0603C]
C43  100nF  [0603C]
C44  100nF  [0603C]
C47  4.7uF  [TAN-A]
C142  4.7uF  [TAN-A]
C143  100nF  [0603C]
C144  100nF  [0603C]
C146  100nF  [0603C]
C147  100nF  [0603C]
CN8  475900001  [MOLEX_47590001]
CN14  475900001  [MOLEX_47590001]
D3  ESDA14V2-2BF3  [BGA4_0R4_0R8X0R8]
D4  USBULC6-2F3  [BGA4_0R4_1X1]
D6  EMIF02-USB03F2  [BGA11_0R5_1R57X2R07]
L1  EXC-3BP121H[BEAD]  [0603L]
L2  EXC-3BP121H[BEAD]  [0603L]
LD5  Green  [0603D]
LD6  Red  [0603D]
LD9  Green  [0603D]
R80  22K  [0603R]
R84  47K  [0603R]
R87  1M  [0603R]
R88  0  [0603R]
R94  10K  [0603R]
R95  0  [0603R]
R96  330  [0603R]
R98  12K[1%]  [0603R]
R100  0  [0603R]
R102  0  [0603R]
R103  820  [0603R]
R106  0  [0603R]
R109  0  [0603R]
R110  4K7  [0603R]
R115  0  [0603R]
R119  0  [0603R]
R121  0  [0603R]
R122  3K3  [0603R]
R123  0  [0603R]
R124  0  [0603R]
R125  0  [0603R]
R126  33  [0603R]
R127  1K  [0603R]
R128  4K7  [0603R]
R135  330  [0603R]
R138  47K  [0603R]
R139  22K  [0603R]
R282  620  [0603R]
R286  22  [0603R]
R288  22  [0603R]
SB12  Closed  [SB_0603]
SB13  Open  [SB_0603]
SB14  Open  [SB_0603]
SB15  Closed  [SB_0603]
T1  9012  [SOT-23]
T2  9013  [SOT-23]
T6  9013  [SOT-23]
U7  STMPS2151STR  [SOT23-5]
U8  USB3300-EZK  [QFN32_0R5_5X5]
X5  24MHz  [XTAL1]

### Ports
OTG_FS2_OverCurrent (out), OTG_FS2_PowerSwitchOn (in), RESET# (in), ULPI_CK (out), ULPI_D[0..7] (bidir), ULPI_DIR (out), ULPI_NXT (out), ULPI_STP (in), USB_FS2_DM (bidir), USB_FS2_DP (bidir), USB_FS2_ID (bidir)

### Nets
+3V3: C143.1 C144.1 C146.1 C147.1 R96.2 R122.1 R128.1 R135.2 R282.2 T1.2(E) U8.6(VDD3.3) U8.16(VDD3.3) U8.25(VDD3.3) U8.30(VDD3.3) U8.31(REG_EN)
+5V: U7.5(IN)
GND: C34.2 C35.2 C36.2 C38.2 C39.2 C41.2 C42.2 C43.2 C44.2 C47.2 C142.2 C143.2 C144.2 C146.2 C147.2 CN14.5(GND) CN14.6(Shield) CN14.7(Shield) CN14.8(Shield) CN14.9(Shield) CN14.10(EXP) D3.B1 D3.B2 D4.B1 D4.B2 D6.D2(GND) L1.1 R80.1 R94.1 R98.1 R110.1 R139.1 T2.2(E) T6.2(E) U7.2(GND) U8.1(GND) U8.2(GND) U8.33(GNDPAD)
VBUS_FS2: CN14.1(VBUS) D6.B3(Vbus) R138.1 SB13.1
VBUS_HS: CN8.1(VBUS) D3.A1 L2.2
PA5: R126.2 ; port ULPI_CK
PB14: D6.D3(D-out) R288.2 ; port USB_FS2_DM
PB15: D6.C3(D+out) R286.2 ; port USB_FS2_DP
PC0: R125.2 ; port ULPI_STP
PH4: R123.2 ; port ULPI_NXT
PI11: R124.2 ; port ULPI_DIR
RESET#: R127.2 ; port RESET#
ULPI_D0: R88.2  [project net PA3]
ULPI_D1: R95.2  [project net PB0]
ULPI_D2: R100.2  [project net PB1]
ULPI_D3: R102.2  [project net PB10]
ULPI_D4: R106.2  [project net PB11]
ULPI_D5: R109.2  [project net PB12]
ULPI_D6: R115.2  [project net PB13]
ULPI_D7: R119.2  [project net PB5]
NetC34_1: C34.1 C35.1 C43.1 C44.1 CN8.5(GND) CN8.6(Shield) CN8.7(Shield) CN8.8(Shield) CN8.9(Shield) CN8.10(EXP) L1.2
NetC36_1: C36.1 SB12.1 SB13.2 U7.1(OUT)
NetC38_1: C38.1 R87.2 U8.28(XI) X5.1
NetC39_1: C39.1 R87.1 U8.27(XO) X5.2
NetC41_1: C41.1 C142.1 U8.29(VDDA1.8)
NetC42_1: C42.1 C47.1 U8.15(VDD1.8) U8.26(VDD1.8)
NetCN8_2: CN8.2(DM) D4.A1 U8.8(DM)
NetCN8_3: CN8.3(DP) D4.A2 U8.7(DP)
NetCN8_4: CN8.4(ID) D3.A2 U8.5(ID)
NetCN14_2: CN14.2(DM) D6.D1(D-in) R288.1
NetCN14_3: CN14.3(DP) D6.C1(D+in) R286.1
NetCN14_4: CN14.4(ID) D6.A3(ID) ; port USB_FS2_ID
NetL2_1: L2.1 R84.2 R103.2 SB12.2
NetLD5_1: LD5.1(A) R96.1
NetLD5_2: LD5.2(K) T6.3(C)
NetLD6_1: LD6.1(A) R282.1
NetLD6_2: LD6.2(K) R121.2 R122.2 U7.3(~{FAULT}) U8.10(EXTVBUS)
NetLD9_1: LD9.1(A) R135.1
NetLD9_2: LD9.2(K) T2.3(C)
NetR80_2: R80.2 R84.1 T6.1(B)
NetR88_1: R88.1 U8.24(D0)
NetR94_2: R94.2 SB14.2 SB15.2 U7.4(EN)
NetR95_1: R95.1 U8.23(D1)
NetR98_2: R98.2 U8.32(RBIAS)
NetR100_1: R100.1 U8.22(D2)
NetR102_1: R102.1 U8.21(D3)
NetR103_1: R103.1 U8.4(VBUS)
NetR106_1: R106.1 U8.20(D4)
NetR109_1: R109.1 U8.19(D5)
NetR110_2: R110.2 T1.3(C) U8.9(RESET)
NetR115_1: R115.1 U8.18(D6)
NetR119_1: R119.1 U8.17(D7)
NetR121_1: R121.1 ; port OTG_FS2_OverCurrent
NetR123_1: R123.1 U8.11(NXT)
NetR124_1: R124.1 U8.12(DIR)
NetR125_1: R125.1 U8.13(STP)
NetR126_1: R126.1 U8.14(CLKOUT)
NetR127_1: R127.1 R128.2 T1.1(B)
NetR138_2: R138.2 R139.2 T2.1(B)
NetSB14_1: SB14.1 ; port OTG_FS2_PowerSwitchOn
NetSB15_1: SB15.1 U8.3(CPEN)

Not connected (* = marked no-connect by the designer): D6 A2(Dz) B1(Pd1) B2(Pup) C2(Pd2)

### Buses and harness runs
bus ULPI_D[0..7] = port ULPI_D[0..7]

### Layout directives
differential pair: NetCN8_2, NetCN8_3, NetCN14_2, NetCN14_3

### Notes on the sheet
- PB13
- PB14
- PB15
- PB12
- MFX_GPIO8
- To MFX
- From MFX
- MFX_GPIO9
- PH4
- PI11
- PC0
- PA5
- PB11
- PB5
- PA3
- PB0
- PB1
- PB10
- (near R128) Soldered if reset is
- (near R128) controlled by hardware
- Title:
- Project:
- Size:
- Date:
- A4
- Reference:
- Sheet:
- Revision:
- of
- (in symbol 475900001) USB_Micro-AB receptacle

### Library data of the parts
C34 C35 C41-C44 C143 C144 C146 C147 = Cap: Capacitor; Value: 10nF; Published: 8-Jun-2000; Revision: July-2002: Re-released for DXP Platform.; Publisher: Altium Limited
C36 = Cap Pol1: as C58 on sheet Power; Published: 8-Jun-2000; Revision: July-2002: Re-released for DXP Platform.; Publisher: Altium Limited
C38 C39 C47 C142 = CAP: Capacitor
L1 L2 = Inductor: Value: 100uH; Published: 8-Jun-2000; Revision: July-2002: Re-released for DXP Platform.; Publisher: Altium Limited
LD5 LD6 LD9 = LED2: as LD10 on sheet Power; Published: 8-Jun-2000; Revision: July-2002: Re-released for DXP Platform.; Publisher: Altium Limited
R80 R84 R94 R96 R103 R122 R135 R138 R139 = res1: Resistor; Value: 1K; Published: 8-Jun-2000; Revision: July-2002: Re-released for DXP Platform.; Publisher: Altium Limited
R87 R88 R95 R98 R100 R102 R106 R109 R110 R115 R119 R121 R123-R126 R128 R282 R286 R288 = Res1: Resistor; Value: 1K; Published: 8-Jun-2000; Revision: July-2002: Re-released for DXP Platform.; Publisher: Altium Limited
R127 = Res1: Resistor; Published: 8-Jun-2000; Revision: July-2002: Re-released for DXP Platform.; Publisher: Altium Limited; Value: 1K
SB12 SB15 = Circuit Breaker_close: Circuit Breaker; Published: 24-Mar-1999; Revision: July-2002: Re-released for DXP Platform.; Publisher: Altium Limited
SB13 SB14 = Circuit Breaker: Published: 24-Mar-1999; Revision: July-2002: Re-released for DXP Platform.; Publisher: Altium Limited
T1 = PNP: PNP Bipolar Transistor; Published: 8-Jun-2000; Revision: July-2002: Re-released for DXP Platform.; Publisher: Altium Limited; Code - JEDEC: SOT-23
T2 T6 = NPN: as T3 on sheet ST_LINK_V2-1; Published: 8-Jun-2000; Revision: July-2002: Re-released for DXP Platform.; Publisher: Altium Limited
U7 = STMPS2141STR
X5 = CRYSTAL

## Sheet USB_OTG_FS.SchDoc: USB_OTG_FS
size A4; DocumentNumber: MB1167; Revision: B.1; SheetNumber: 9; SheetTotal: 17; Project: STM327x6G-EVAL
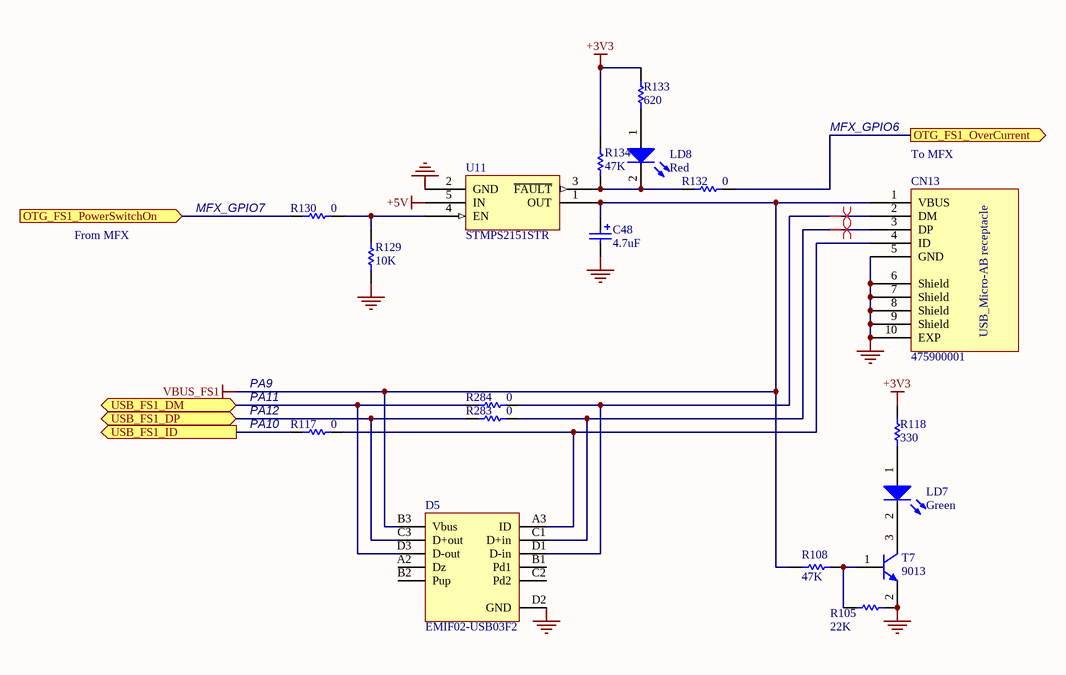
[diagram p12: USB_OTG_FS.SchDoc]

### Parts
C48  4.7uF  [TAN-A]
CN13  475900001  [MOLEX_47590001]
D5  EMIF02-USB03F2  [BGA11_0R5_1R57X2R07]
LD7  Green  [0603D]
LD8  Red  [0603D]
R105  22K  [0603R]
R108  47K  [0603R]
R117  0  [0603R]
R118  330  [0603R]
R129  10K  [0603R]
R130  0  [0603R]
R132  0  [0603R]
R133  620  [0603R]
R134  47K  [0603R]
R283  0  [0603R]
R284  0  [0603R]
T7  9013  [SOT-23]
U11  STMPS2151STR  [SOT23-5]

### Ports
OTG_FS1_OverCurrent (out), OTG_FS1_PowerSwitchOn (in), USB_FS1_DM (bidir), USB_FS1_DP (bidir), USB_FS1_ID (out)

### Nets
+3V3: R118.2 R133.2 R134.1
+5V: U11.5(IN)
GND: C48.2 CN13.5(GND) CN13.6(Shield) CN13.7(Shield) CN13.8(Shield) CN13.9(Shield) CN13.10(EXP) D5.D2(GND) R105.1 R129.1 T7.2(E) U11.2(GND)
VBUS_FS1: C48.1 CN13.1(VBUS) D5.B3(Vbus) R108.1 U11.1(OUT)
PA10: R117.2 ; port USB_FS1_ID
PA11: D5.D3(D-out) R284.2 ; port USB_FS1_DM
NetCN13_2: CN13.2(DM) D5.D1(D-in) R284.1
NetCN13_3: CN13.3(DP) D5.C1(D+in) R283.1
NetCN13_4: CN13.4(ID) D5.A3(ID) R117.1
NetD5_C3: D5.C3(D+out) R283.2 ; port USB_FS1_DP
NetLD7_1: LD7.1(A) R118.1
NetLD7_2: LD7.2(K) T7.3(C)
NetLD8_1: LD8.1(A) R133.1
NetLD8_2: LD8.2(K) R132.2 R134.2 U11.3(~{FAULT})
NetR105_2: R105.2 R108.2 T7.1(B)
NetR129_2: R129.2 R130.1 U11.4(EN)
NetR130_2: R130.2 ; port OTG_FS1_PowerSwitchOn
NetR132_1: R132.1 ; port OTG_FS1_OverCurrent

Not connected (* = marked no-connect by the designer): D5 A2(Dz) B1(Pd1) B2(Pup) C2(Pd2)

### Layout directives
differential pair: NetCN13_2, NetCN13_3

### Notes on the sheet
- MFX_GPIO6
- (near R130) MFX_GPIO7
- (near CN13) To MFX
- From MFX
- PA9
- (near R117) PA11
- (near R117) PA12
- (near R117) PA10
- Title:
- Project:
- Size:
- Date:
- A4
- Reference:
- Sheet:
- Revision:
- of
- (in symbol 475900001) USB_Micro-AB receptacle

### Library data of the parts
C48 = Cap Pol1: as C58 on sheet Power; Published: 8-Jun-2000; Revision: July-2002: Re-released for DXP Platform.; Publisher: Altium Limited
LD7 LD8 = LED2: as LD10 on sheet Power; Published: 8-Jun-2000; Revision: July-2002: Re-released for DXP Platform.; Publisher: Altium Limited
R105 R108 R118 R134 = res1: Resistor; Value: 1K; Published: 8-Jun-2000; Revision: July-2002: Re-released for DXP Platform.; Publisher: Altium Limited
R117 R129 R130 R132 R133 R283 R284 = Res1: Resistor; Value: 1K; Published: 8-Jun-2000; Revision: July-2002: Re-released for DXP Platform.; Publisher: Altium Limited
T7 = NPN: as T3 on sheet ST_LINK_V2-1; Published: 8-Jun-2000; Revision: July-2002: Re-released for DXP Platform.; Publisher: Altium Limited
U11 = STMPS2141STR

## Sheet RS232&IrDA.SchDoc: RS232 & IrDA
size A4; DocumentNumber: MB1167; Revision: B.1; SheetNumber: 10; SheetTotal: 17; Project: STM327x6G-EVAL
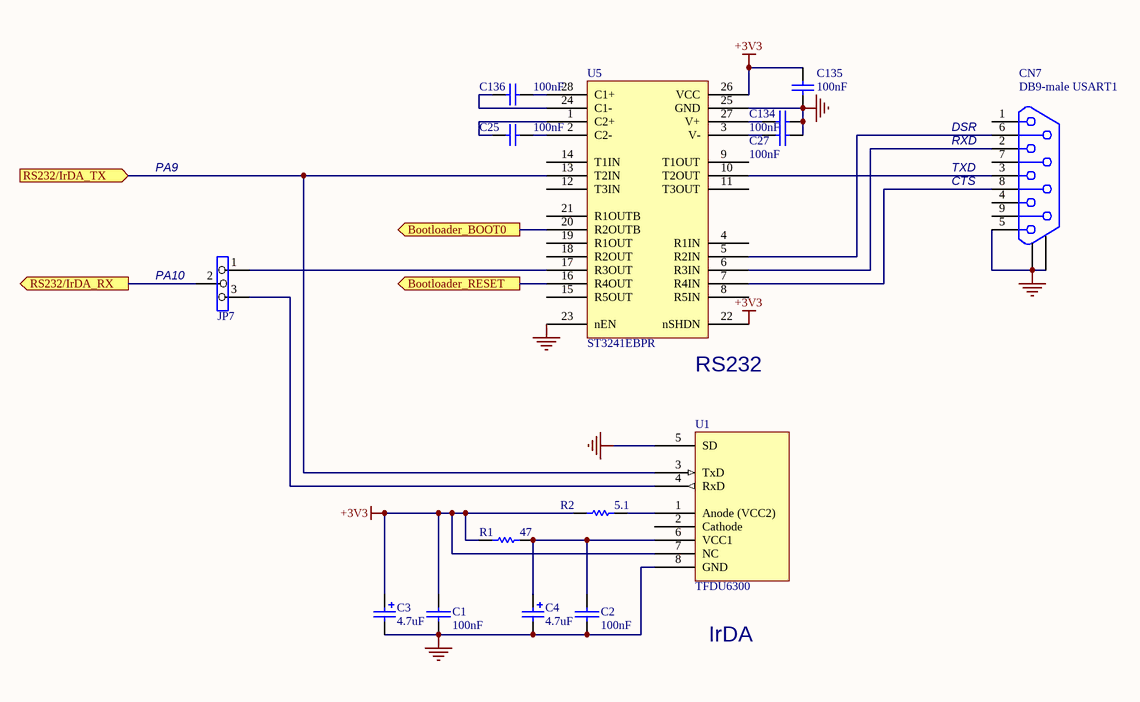
[diagram p13: RS232&IrDA.SchDoc]

### Parts
C1  100nF  [0603C]
C2  100nF  [0603C]
C3  4.7uF  [TAN-A]
C4  4.7uF  [TAN-A]
C25  100nF  [0603C]
C27  100nF  [0603C]
C134  100nF  [0603C]
C135  100nF  [0603C]
C136  100nF  [0603C]
CN7  DB9-male USART1  [DB9/M]
JP7  (no value)  [SIP3]
R1  47  [0603R]
R2  5.1  [0603R]
U1  TFDU6300  [IR_VISHAY3]
U5  ST3241EBPR  [SSOP28_0R65_10R2X7R8]

### Ports
Bootloader_BOOT0 (out), Bootloader_RESET (out), RS232/IrDA_RX (out), RS232/IrDA_TX (in)

### Nets
+3V3: C1.1 C3.1 C135.1 R1.1 R2.1 U1.7(NC) U5.22(nSHDN) U5.26(VCC)
GND: C1.2 C2.2 C3.2 C4.2 C27.1 C134.1 C135.2 CN7.5 CN7.10 CN7.11 U1.5(SD) U1.8(GND) U5.23(nEN) U5.25(GND)
NetC2_1: C2.1 C4.1 R1.2 U1.6(VCC1)
NetC25_1: C25.1 U5.1(C2+)
NetC25_2: C25.2 U5.2(C2-)
NetC27_2: C27.2 U5.3(V-)
NetC134_2: C134.2 U5.27(V+)
NetC136_1: C136.1 U5.24(C1-)
NetC136_2: C136.2 U5.28(C1+)
NetCN7_2: CN7.2 U5.6(R3IN)
NetCN7_3: CN7.3 U5.10(T2OUT)
NetCN7_6: CN7.6 U5.5(R2IN)
NetCN7_8: CN7.8 U5.7(R4IN)
NetD1_1: U5.20(R2OUTB) ; port Bootloader_BOOT0
NetJP3_2: U5.16(R4OUT) ; port Bootloader_RESET
NetJP7_1: JP7.1 U5.17(R3OUT)
NetJP7_2: JP7.2 ; port RS232/IrDA_RX
NetJP7_3: JP7.3 U1.4(RxD)
NetJP20_1: U1.3(TxD) U5.13(T2IN) ; port RS232/IrDA_TX
NetR2_2: R2.2 U1.1(Anode_(VCC2))

Not connected (* = marked no-connect by the designer): CN7 1 4 7 9; U1 2(Cathode); U5 4(R1IN) 8(R5IN) 9(T1OUT) 11(T3OUT) 12(T3IN) 14(T1IN) 15(R5OUT) 18(R2OUT) 19(R1OUT) 21(R1OUTB)

### Notes on the sheet
- PA9
- (near CN7) RXD
- (near CN7) TXD
- (near CN7) DSR
- (near CN7) CTS
- (near JP7) PA10
- (near U5) RS232
- IrDA
- Title:
- Project:
- Size:
- Date:
- A4
- Reference:
- Sheet:
- Revision:
- of

### Library data of the parts
C1 C2 = CAP: Capacitor
C3 C4 = Cap Pol1: Polarized Capacitor (Radial); Value: 100pF; Published: 8-Jun-2000; Revision: July-2002: Re-released for DXP Platform.; Publisher: Altium Limited
C25 C27 C134-C136 = Cap: Capacitor; Value: 10nF; Published: 8-Jun-2000; Revision: July-2002: Re-released for DXP Platform.; Publisher: Altium Limited
CN7 = DB9-USART
JP7 = Jumper3
R1 R2 = Res1: Resistor; Value: 1K; Published: 8-Jun-2000; Revision: July-2002: Re-released for DXP Platform.; Publisher: Altium Limited
U1 = TFDU4300
U5 = ST3241

## Sheet LCD&Camera&Connectors.SchDoc: LCD & Camera & Connector
size A4; DocumentNumber: MB1167; Revision: B.1; SheetNumber: 6; SheetTotal: 17; Project: STM327x6G-EVAL
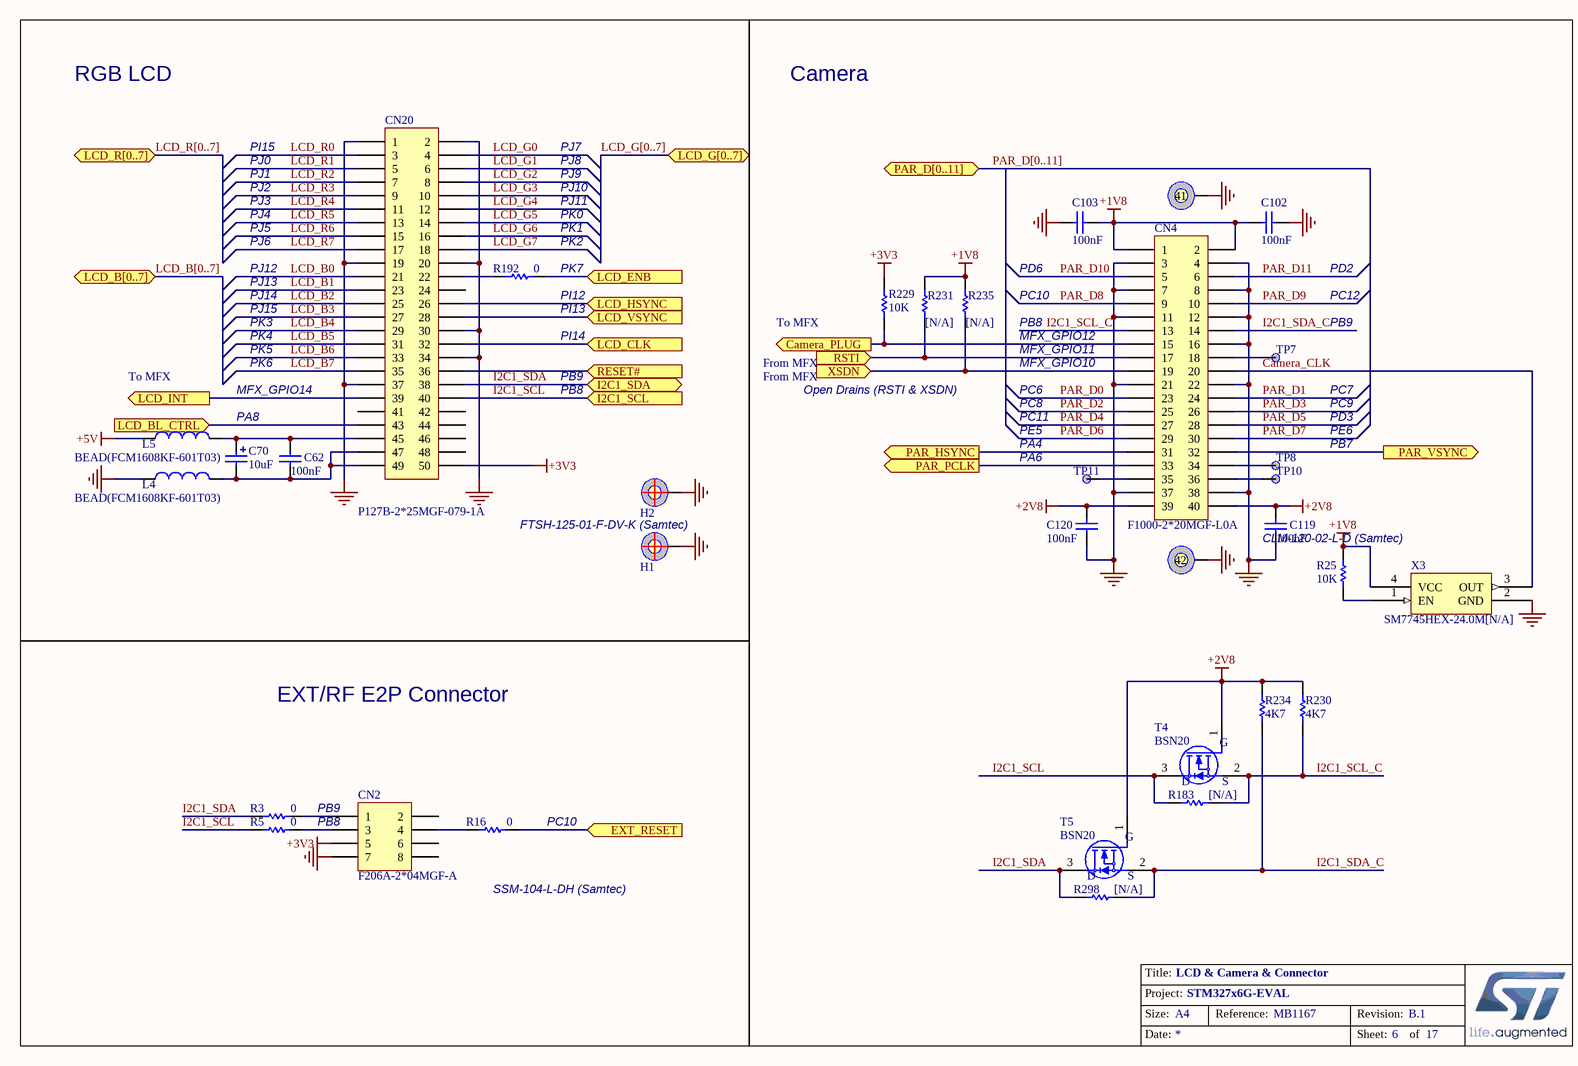
[diagram p14: LCD&Camera&Connectors.SchDoc]

### Parts
C62  100nF  [0603C]
C70  10uF  [TAN-A]
C102  100nF  [0603C]
C103  100nF  [0603C]
C119  100nF  [0603C]
C120  100nF  [0603C]
CN2  F206A-2*04MGF-A  [SSM-104-L-DH]
CN4  F1000-2*20MGF-L0A  [CLM-120-02-L-D]
CN20  P127B-2*25MGF-079-1A  [FTSH-125-01-F-DV]
H1  POSITION HOLE  [HOLE_C9D4R5]  (value not drawn)
H2  POSITION HOLE  [HOLE_C9D4R5]  (value not drawn)
L4  BEAD(FCM1608KF-601T03)  [0603L]
L5  BEAD(FCM1608KF-601T03)  [0603L]
R3  0  [0603R]
R5  0  [0603R]
R16  0  [0603R]
R25  10K  [0402R]
R183  [N/A]  [0603R]
R192  0  [0603R]
R229  10K  [0603R]
R230  4K7  [0603R]
R231  [N/A]  [0603R]
R234  4K7  [0603R]
R235  [N/A]  [0603R]
R298  [N/A]  [0603R]
T4  BSN20  [SOT-23]
T5  BSN20  [SOT-23]
TP7  (no value)  [TP]
TP8  (no value)  [TP]
TP10  (no value)  [TP]
TP11  (no value)  [TP]
X3  SM7745HEX-24.0M[N/A]  [OSC_4SM_7X5]

### Ports
Camera_PLUG (out), EXT_RESET (in), I2C1_SCL (in), I2C1_SDA (bidir), LCD_B[0..7] (bidir), LCD_BL_CTRL (in), LCD_CLK (in), LCD_ENB (in), LCD_G[0..7] (bidir), LCD_HSYNC (in), LCD_INT (out), LCD_R[0..7] (bidir), LCD_VSYNC (in), PAR_D[0..11] (bidir), PAR_HSYNC (out), PAR_PCLK (out), PAR_VSYNC (out), RESET# (in), RSTI (in), XSDN (in)

### Nets
+1V8: C102.1 C103.2 CN4.1 CN4.2 R25.2 R231.2 R235.2 X3.4(VCC)
+2V8: C119.1 C120.1 CN4.39 CN4.40 R230.2 R234.2 T4.1(G) T5.1(G)
+3V3: CN2.5 CN20.50 R229.1
+5V: L5.1
GND: C102.2 C103.1 C119.2 C120.2 CN2.7 CN4.3 CN4.4 CN4.7 CN4.8 CN4.11 CN4.12 CN4.16 CN4.21 CN4.22 CN4.37 CN4.38 CN4.41 CN4.42 CN20.1 CN20.2 CN20.19 CN20.20 CN20.30 CN20.34 CN20.37 H1.1 H2.1 L4.1 X3.2(GND)
Camera_CLK: CN4.20 X3.3(OUT)
I2C1_SCL: CN20.40 R5.1 R183.1 T4.3(D) ; port I2C1_SCL
I2C1_SCL_C: CN4.13 R183.2 R230.1 T4.2(S)
I2C1_SDA: CN20.38 R3.1 R298.1 T5.3(D) ; port I2C1_SDA
I2C1_SDA_C: CN4.14 R234.1 R298.2 T5.2(S)
LCD_B0: CN20.21
LCD_B1: CN20.23
LCD_B2: CN20.25
LCD_B3: CN20.27
LCD_B4: CN20.29
LCD_B5: CN20.31
LCD_B6: CN20.33
LCD_B7: CN20.35
LCD_G0: CN20.4
LCD_G1: CN20.6
LCD_G2: CN20.8
LCD_G3: CN20.10
LCD_G4: CN20.12
LCD_G5: CN20.14
LCD_G6: CN20.16
LCD_G7: CN20.18
LCD_R0: CN20.3
LCD_R1: CN20.5
LCD_R2: CN20.7
LCD_R3: CN20.9
LCD_R4: CN20.11
LCD_R5: CN20.13
LCD_R6: CN20.15
LCD_R7: CN20.17
PA4: CN4.31 ; port PAR_HSYNC
PAR_D0: CN4.23  [project net I2S3_CK]
PAR_D1: CN4.24
PAR_D2: CN4.25
PAR_D3: CN4.26
PAR_D4: CN4.27
PAR_D5: CN4.28
PAR_D6: CN4.29
PAR_D7: CN4.30
PAR_D8: CN4.9 R16.2 ; port EXT_RESET
PAR_D9: CN4.10
PAR_D10: CN4.5
PAR_D11: CN4.6
PI12: CN20.26 ; port LCD_HSYNC
PI13: CN20.28 ; port LCD_VSYNC
PI14: CN20.32 ; port LCD_CLK
PK7: R192.2 ; port LCD_ENB
RESET#: CN20.36 ; port RESET#
NetC62_1: C62.1 C70.1 CN20.45 L5.2
NetC62_2: C62.2 C70.2 CN20.47 CN20.49 L4.2
NetCN2_1: CN2.1 R3.2
NetCN2_3: CN2.3 R5.2
NetCN2_4: CN2.4 R16.1
NetCN4_15: CN4.15 R229.2 ; port Camera_PLUG
NetCN4_17: CN4.17 R231.1 ; port RSTI
NetCN4_18: CN4.18 TP7.1
NetCN4_19: CN4.19 R235.1 ; port XSDN
NetCN4_32: CN4.32 ; port PAR_VSYNC
NetCN4_33: CN4.33 ; port PAR_PCLK
NetCN4_34: CN4.34 TP8.1
NetCN4_35: CN4.35 TP11.1
NetCN4_36: CN4.36 TP10.1
NetCN20_22: CN20.22 R192.1
NetCN20_39: CN20.39 ; port LCD_INT
NetCN20_43: CN20.43 ; port LCD_BL_CTRL
NetR25_1: R25.1 X3.1(EN)

Not connected (* = marked no-connect by the designer): CN2 2 6 8; CN20 24 41 42 44 46 48

### Buses and harness runs
bus LCD_B[0..7] = port LCD_B[0..7]
bus LCD_G[0..7] = port LCD_G[0..7]
bus LCD_R[0..7] = port LCD_R[0..7]
bus PAR_D[0..11] = port PAR_D[0..11]

### Notes on the sheet
- RGB LCD
- Camera
- PI15
- PJ0
- PJ1
- PJ2
- PJ7
- PJ8
- PJ9
- PJ10
- PJ3
- PJ4
- PJ5
- PJ6
- PJ11
- PK0
- (near R192) PK1
- (near R192) PK2
- PJ12
- PJ13
- PJ14
- PJ15
- PK3
- (near R192) PK7
- (near R192) PI12
- (near R192) PI13
- To MFX
- PC10
- PB8
- PD6
- PB9
- PD2
- PC12
- MFX_GPIO14
- PK4
- PK5
- PK6
- PI14
- From MFX
- Open Drains (RSTI & XSDN)
- PC6
- MFX_GPIO12
- MFX_GPIO10
- MFX_GPIO11
- PC7
- PA8
- PC11
- PE5
- PA4
- PA6
- PC8
- PE6
- PC9
- PB7
- PD3
- FTSH-125-01-F-DV-K (Samtec)
- (near CN4) CLM-120-02-L-D (Samtec)
- EXT/RF E2P Connector
- (near R16) PC10
- (near CN2) SSM-104-L-DH (Samtec)
- Title:
- Project:
- Size:
- Date:
- A4
- Reference:
- Sheet:
- Revision:
- of

### Library data of the parts
C62 C102 C103 C119 C120 = Cap: Capacitor; Value: 10nF; Published: 8-Jun-2000; Revision: July-2002: Re-released for DXP Platform.; Publisher: Altium Limited
C70 = Cap Pol1: Polarized Capacitor (Radial); Published: 8-Jun-2000; Revision: July-2002: Re-released for DXP Platform.; Publisher: Altium Limited; Value: 10uF
CN2 = SSM-104-L-DH: Header, 5-Pin, Dual row; Revision: 17-Jul-2002: Re-released for DXP Platform.; Publisher: Altium Limited
CN4 = CLM-120-02-L-D: Header, 20-Pin, Dual row; Revision: 17-Jul-2002: Re-released for DXP Platform.; Publisher: Altium Limited
CN20 = Header 25X2: Header, 26-Pin, Dual row; Revision: 17-Jul-2002: Re-released for DXP Platform.; Publisher: Altium Limited
L4 L5 = Inductor: Value: 100uH; Published: 8-Jun-2000; Revision: July-2002: Re-released for DXP Platform.; Publisher: Altium Limited
R3 R5 R16 R25 R183 R192 R229 R298 = Res1: Resistor; Value: 1K; Published: 8-Jun-2000; Revision: July-2002: Re-released for DXP Platform.; Publisher: Altium Limited
R230 R231 R234 R235 = res1: Resistor; Value: 1K; Published: 8-Jun-2000; Revision: July-2002: Re-released for DXP Platform.; Publisher: Altium Limited
T4 T5 = 2N7000
TP7 TP8 TP10 TP11 = TP
X3 = SM7745HEV-50.0M

## Sheet MFX.SchDoc: MFX
size A4; DocumentNumber: MB1167; Revision: B.1; SheetNumber: 16; SheetTotal: 17; Project: STM327x6G-EVAL
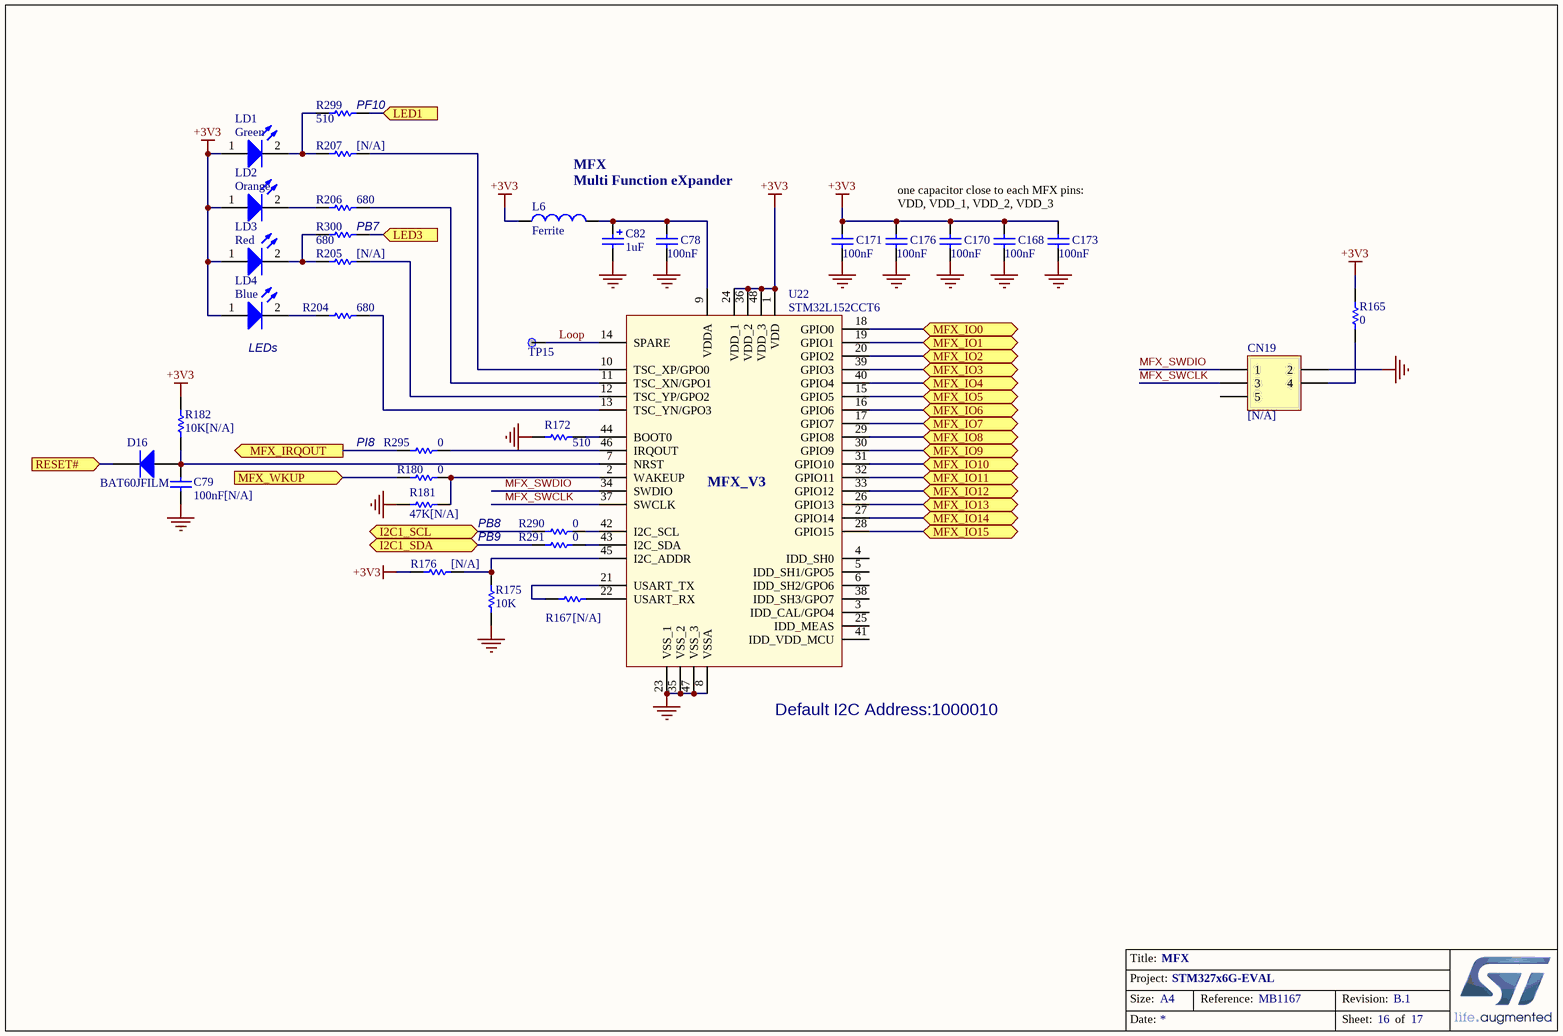
[diagram p15: MFX.SchDoc]

### Parts
C78  100nF  [0402C]
C79  100nF[N/A]  [0402C]
C82  1uF  [TAN-A]
C168  100nF  [0402C]
C170  100nF  [0402C]
C171  100nF  [0402C]
C173  100nF  [0402C]
C176  100nF  [0402C]
CN19  [N/A]  [HDR_2X3-1_2R54-6]
D16  BAT60JFILM  [SOD-323]
L6  Ferrite  [0603L]
LD1  Green  [0603D]
LD2  Orange  [0603D]
LD3  Red  [0603D]
LD4  Blue  [0603D]
R165  0  [0603R]
R167  [N/A]  [0603R]
R172  510  [0402R]
R175  10K  [0402R]
R176  [N/A]  [0603R]
R180  0  [0603R]
R181  47K[N/A]  [0402R]
R182  10K[N/A]  [0402R]
R204  680  [0603R]
R205  [N/A]  [0603R]
R206  680  [0603R]
R207  [N/A]  [0603R]
R290  0  [0603R]
R291  0  [0603R]
R295  0  [0603R]
R299  510  [0603R]
R300  680  [0603R]
TP15  (no value)  [TP]
U22  STM32L152CCT6  [LQFP48_0R5_9X9]

### Ports
I2C1_SCL (bidir), I2C1_SDA (bidir), LED1 (in), LED3 (in), MFX_IO0 (bidir), MFX_IO1 (bidir), MFX_IO2 (bidir), MFX_IO3 (bidir), MFX_IO4 (bidir), MFX_IO5 (bidir), MFX_IO6 (bidir), MFX_IO7 (bidir), MFX_IO8 (bidir), MFX_IO9 (bidir), MFX_IO10 (bidir), MFX_IO11 (bidir), MFX_IO12 (bidir), MFX_IO13 (bidir), MFX_IO14 (bidir), MFX_IO15 (bidir), MFX_IRQOUT (out), MFX_WKUP (in), RESET# (in)

### Nets
+3V3: C168.2 C170.1 C171.2 C173.2 C176.2 L6.1 LD1.1(A) LD2.1(A) LD3.1(A) LD4.1(A) R165.1 R176.2 R182.2 U22.1(VDD) U22.24(VDD_1) U22.36(VDD_2) U22.48(VDD_3)
GND: C78.1 C79.1 C82.2 C168.1 C170.2 C171.1 C173.1 C176.1 CN19.2 R172.2 R175.2 R181.1 U22.8(VSSA) U22.23(VSS_1) U22.35(VSS_2) U22.47(VSS_3)
I2C1_SCL: R290.1 ; port I2C1_SCL
I2C1_SDA: R291.1 ; port I2C1_SDA
Loop: TP15.1 U22.14(SPARE)
MFX_SWCLK: CN19.3 U22.37(SWCLK)
MFX_SWDIO: CN19.1 U22.34(SWDIO)
PC13: R180.2 ; port MFX_WKUP
PI8: R295.1 ; port MFX_IRQOUT
RESET#: D16.2(K) ; port RESET#
NetB3_1: U22.20(GPIO2) ; port MFX_IO2
NetB3_2: U22.18(GPIO0) ; port MFX_IO0
NetB3_3: U22.19(GPIO1) ; port MFX_IO1
NetB3_4: U22.39(GPIO3) ; port MFX_IO3
NetB3_6: U22.40(GPIO4) ; port MFX_IO4
NetC78_2: C78.2 C82.1 L6.2 U22.9(VDDA)
NetC79_2: C79.2 D16.1(A) R182.1 U22.7(NRST)
NetCN4_15: U22.33(GPIO12) ; port MFX_IO12
NetCN4_17: U22.32(GPIO11) ; port MFX_IO11
NetCN4_19: U22.31(GPIO10) ; port MFX_IO10
NetCN19_4: CN19.4 R165.2
NetCN20_39: U22.27(GPIO14) ; port MFX_IO14
NetJP23_3: R300.1 ; port LED3
NetJP24_3: R299.1 ; port LED1
NetLD1_2: LD1.2(K) R207.2 R299.2
NetLD2_2: LD2.2(K) R206.2
NetLD3_2: LD3.2(K) R205.2 R300.2
NetLD4_2: LD4.2(K) R204.2
NetR74_2: U22.26(GPIO13) ; port MFX_IO13
NetR121_1: U22.29(GPIO8) ; port MFX_IO8
NetR130_2: U22.17(GPIO7) ; port MFX_IO7
NetR132_1: U22.16(GPIO6) ; port MFX_IO6
NetR154_1: U22.28(GPIO15) ; port MFX_IO15
NetR167_1: R167.1 U22.21(USART_TX)
NetR167_2: R167.2 U22.22(USART_RX)
NetR172_1: R172.1 U22.44(BOOT0)
NetR175_1: R175.1 R176.1 U22.45(I2C_ADDR)
NetR180_1: R180.1 R181.2 U22.2(WAKEUP)
NetR204_1: R204.1 U22.13(TSC_YN/GPO3)
NetR205_1: R205.1 U22.12(TSC_YP/GPO2)
NetR206_1: R206.1 U22.11(TSC_XN/GPO1)
NetR207_1: R207.1 U22.10(TSC_XP/GPO0)
NetR290_2: R290.2 U22.42(I2C_SCL)
NetR291_2: R291.2 U22.43(I2C_SDA)
NetR295_2: R295.2 U22.46(IRQOUT)
NetSB14_1: U22.30(GPIO9) ; port MFX_IO9
NetU22_15: U22.15(GPIO5) ; port MFX_IO5

Not connected (* = marked no-connect by the designer): CN19 5; U22 3(IDD_CAL/GPO4) 4(IDD_SH0) 5(IDD_SH1/GPO5) 6(IDD_SH2/GPO6) 25(IDD_MEAS) 38(IDD_SH3/GPO7) 41(IDD_VDD_MCU)

### Notes on the sheet
- (near R299) PF10
- (near R300) PB7
- MFX
  Multi Function eXpander
- one capacitor close to each MFX pins: VDD, VDD_1, VDD_2, VDD_3
- (near LD4) LEDs
- PI8
- PB8
- PB9
- (near U22) Default I2C Address:1000010
- Title:
- Project:
- Size:
- Date:
- A4
- Reference:
- Sheet:
- Revision:
- of
- (in symbol MFX) MFX_V3

### Library data of the parts
C78 C79 C168 C170 C171 C173 C176 = Cap_100nF_X7R_10%_0402: Capacitor,100nF,16V,X7R,10%,0402,YAGEO; Manuf_Part_1: CC0402KRX7R7BB104; Revision: July-2002: Re-released for DXP Platform.; Value: 100nF; Order: CC0402KRX7R7BB104; Manuf_1: YAGEO
C82 = Cap_1uF_POL_10%_TANA: Polarized Capacitor,1uF,16V,10%,typeA,AVX; Manuf_Part_1: TAJA105K016R; Revision: July-2002: Re-released for DXP Platform.; Value: 1uF; Order: TAJA105K016R; Manuf_1: AVX; Distrib: *
CN19 = Header 3X2: Header, 3-Pin, Dual row; Revision: 17-Jul-2002: Re-released for DXP Platform.; Publisher: Altium Limited
D16 = Diode: Default Diode; Code - JEDEC: DO-214-AB; Published: 8-Jun-2000; Revision: July-2002: Re-released for DXP Platform.; Publisher: Altium Limited
L6 = BEAD_600R_350MA_0603: Bead,600R,350mA,0603,FCM1608KF-601T03,Tai-tech; Manuf_2: TDK; Manuf_Part_2: MPZ1608S300A; Value: 100uH; Comment_1: bead,30R,5A,0603,MPZ1608S300A,TDK; Revision: July-2002: Re-released for DXP Platform.; Manuf_Part_1: FCM1608KF-601T03; Order: FCM1608KF-601T03; Manuf_1: Tai-tech
LD1-LD4 = LED2: as LD10 on sheet Power; Published: 8-Jun-2000; Revision: July-2002: Re-released for DXP Platform.; Publisher: Altium Limited
R165 R290 R291 R295 = Res1: Resistor; Value: 1K; Ordered by: Subcon; Published: 8-Jun-2000; Revision: July-2002: Re-released for DXP Platform.; Publisher: Altium Limited
R167 = res1: Resistor; Value: 1K; Ordered by: Subcon; Published: 8-Jun-2000; Revision: July-2002: Re-released for DXP Platform.; Publisher: Altium Limited
R172 R181 R182 = Resistor_ST: as R151 on sheet ST_LINK_V2-1
R175 = Resistor_ST: as R159 on sheet ST_LINK_V2-1; Value: 10K
R176 R180 R204-R207 R299 R300 = Res1: Resistor; Value: 1K; Published: 8-Jun-2000; Revision: July-2002: Re-released for DXP Platform.; Publisher: Altium Limited
TP15 = TP
U22 = MFX: Multifunction expander